# Altium schematic sheet Conectores.SchDoc: GRUPO ALTECH
size A3; DocumentNumber: GA0070; SheetNumber: 3; SheetTotal: 4
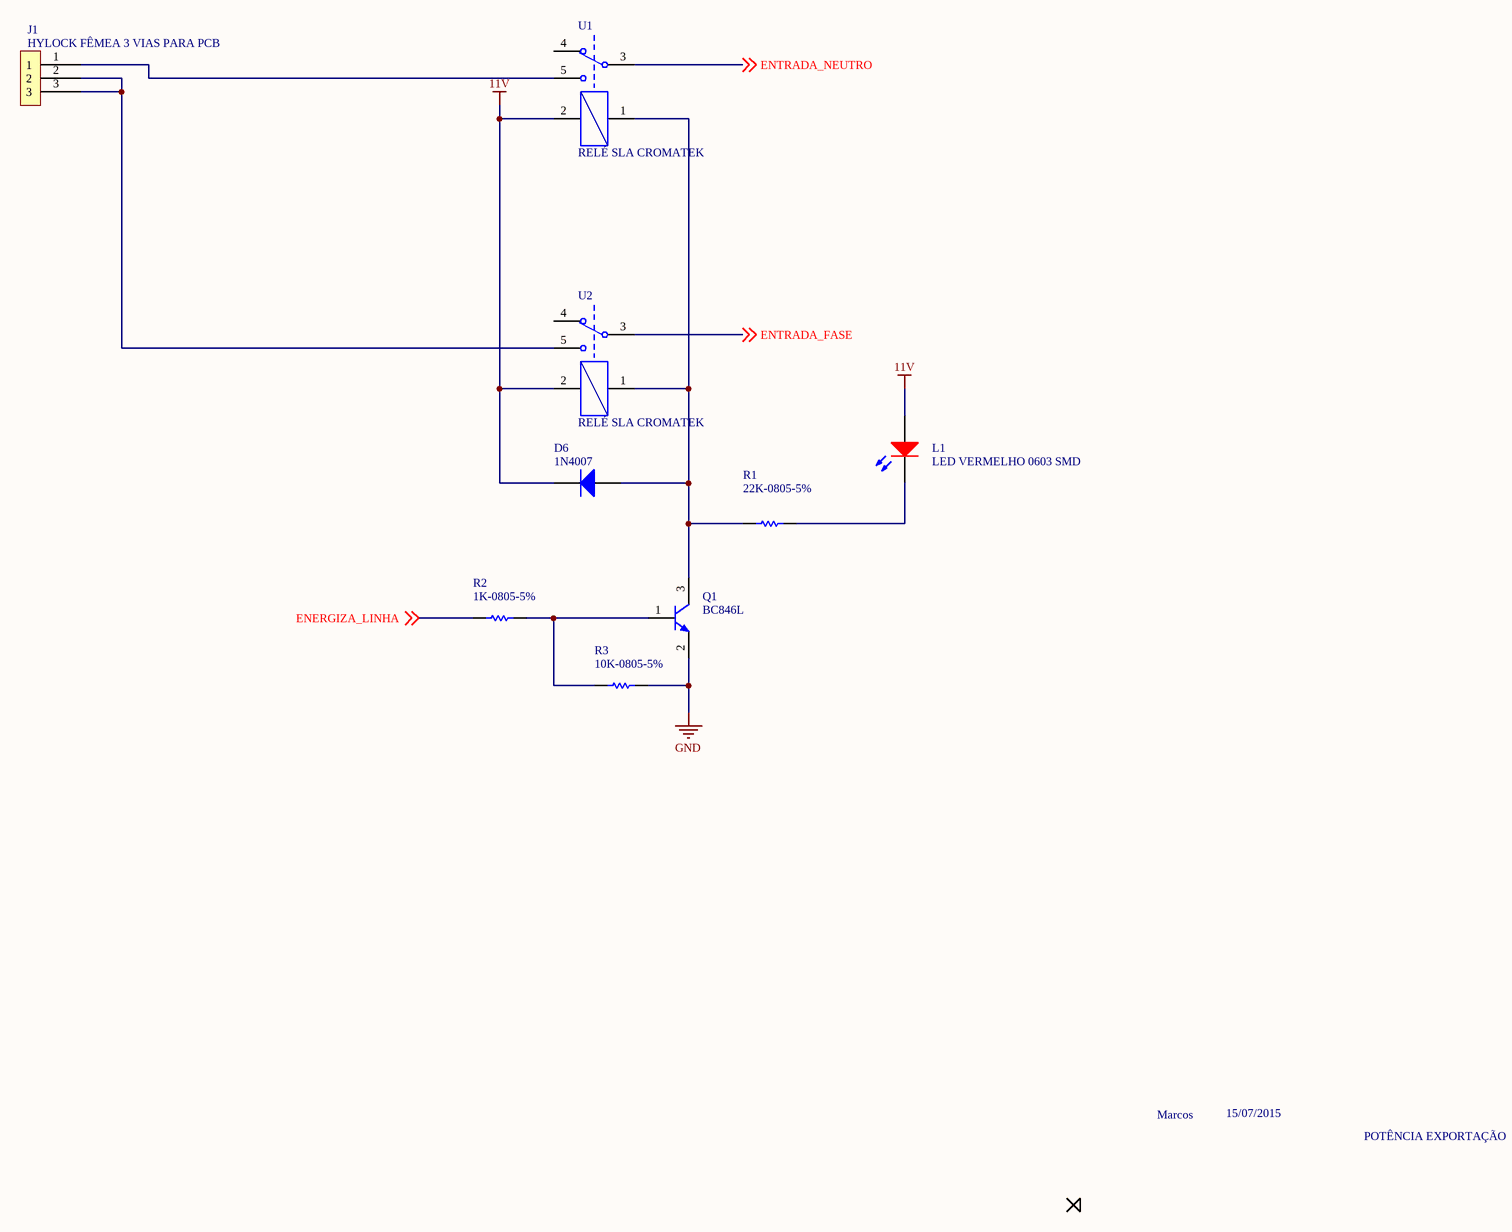
[diagram p0: Conectores.SchDoc]

## Parts
D6  1N4007  [SMA DIODES]
J1  HYLOCK FÊMEA 3 VIAS PARA PCB  [CONECTOR HYLOCK 3 VIAS]
L1  LED VERMELHO 0603 SMD  [LED 1206]
Q1  BC846L  [SOT23 - REVISADO ONDA]
R1  22K-0805-5%  [0805-REVISADO ONDA]
R2  1K-0805-5%  [0805-REVISADO ONDA]
R3  10K-0805-5%  [0805-REVISADO ONDA]
U1  RELÉ SLA CROMATEK  [RELE SLA CROMATEK]
U2  RELÉ SLA CROMATEK  [RELE SLA CROMATEK]

## Nets
11V: D6.2(K) L1.1(A) U1.2(A2) U2.2(A2)
GND: Q1.2(E) R3.2
ENERGIZA_LINHA: R2.1 ; off-sheet ENERGIZA_LINHA
ENTRADA_FASE: U2.3 ; off-sheet ENTRADA_FASE
ENTRADA_NEUTRO: U1.3 ; off-sheet ENTRADA_NEUTRO
NetD6_1: D6.1(A) Q1.3(C) R1.1 U1.1(A1) U2.1(A1)
NetJ1_1: J1.1 U1.5
NetJ1_2: J1.2 J1.3 U2.5
NetL1_2: L1.2(K) R1.2
NetQ1_1: Q1.1(B) R2.2 R3.1

Not connected (* = marked no-connect by the designer): U1 4; U2 4

## Notes on the sheet
- Marcos
- 15/07/2015
- POTÊNCIA EXPORTAÇÃO
- NOME
- DATA
- CLIENTE
- PROJETO
- desenho
- verif.
- aprov.
- TAMANHO
- CODIGO
- Todas as informações disponíveis
- não devem ser divulgadas,
- em parte ou todo.
- www.dextro-st.com.br
- CIRCUITO IMPRESSO
- MONTAGEM ELETRÔNICA
- A4
- de

## Library data of the parts
J1 = PCMC2-3
Q1 = BC846: ERP: 106.22.001
R2 = 10K-0805-5%: ERP: 102.11.054
D6 = 1N4007: ERP: 120.18.001
L1 = LED VERMELHO 0603 SMD: ERP: 124.02.010
R1 = 22K-0805-5%: ERP: 102.11.058
R3 = 10K-0805-5%: ERP: 102.11.054